# EAGLE design icetube (EAGLE 6.4)
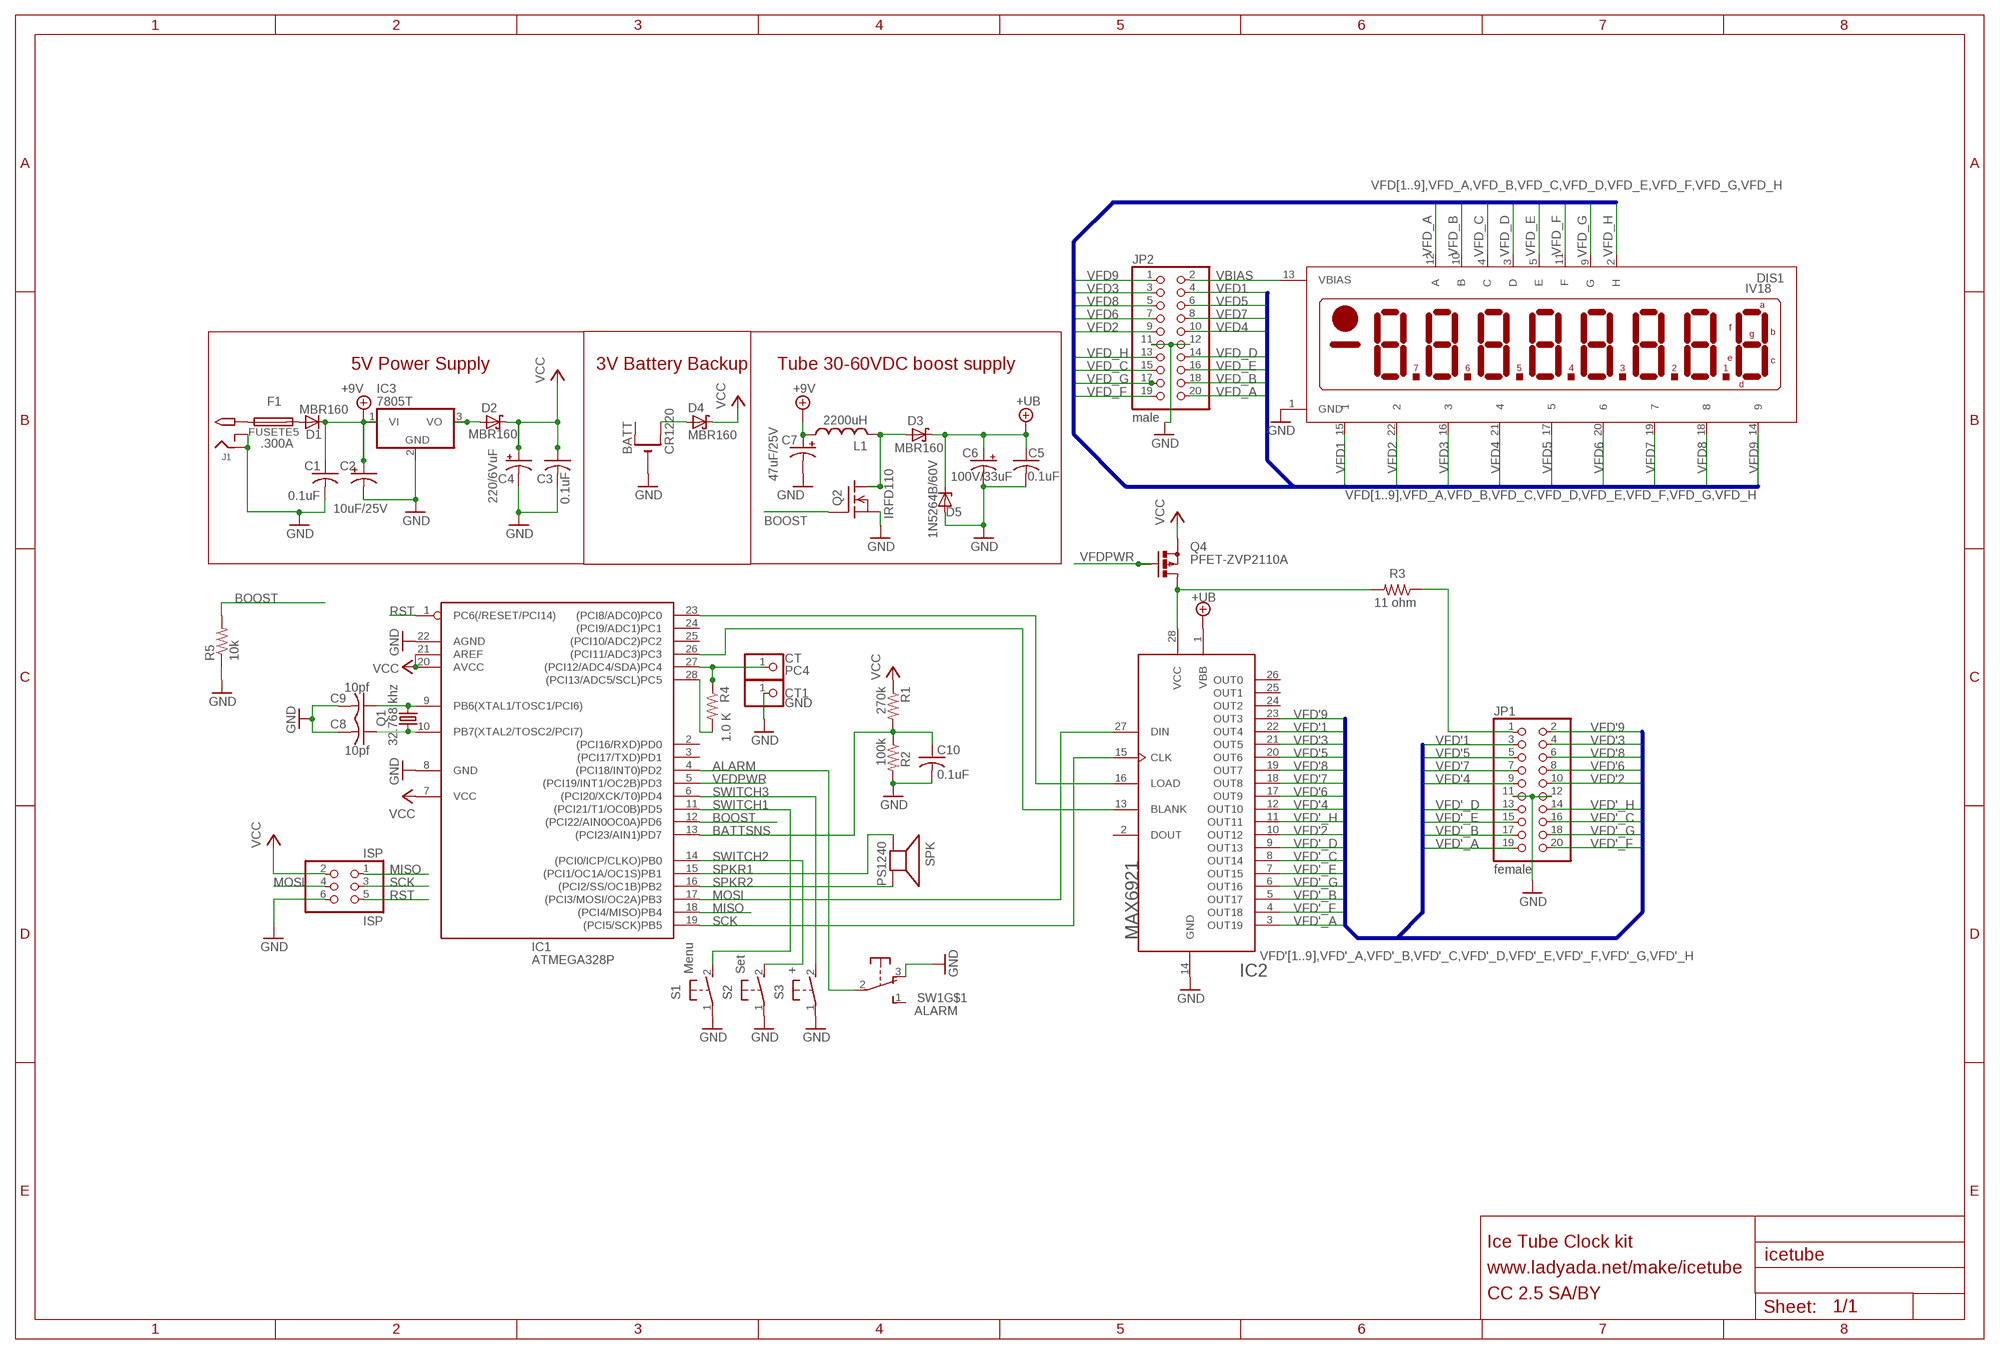
[diagram p0: schematic, sheet 1]

## Parts
BATT  CR1220  CR1220THM  [CR1220-THM]
C1  0.1uF  C-US025-025X050  [C025-025X050]
C2  10uF/25V  CPOL-USE2.5-6  [E2,5-6]
C3  0.1uF  C-US025-025X050  [C025-025X050]
C4  220/6VuF  CPOL-USE2.5-6  [E2,5-6]
C5  0.1uF  C-US025-024X044  [C025-024X044]
C6  100V/33uF  CPOL-USE3.5-8  [E3,5-8]
C7  47uF/25V  CPOL-USE2.5-6  [E2,5-6]
C8  10pf  C-US025-025X050  [C025-025X050]
C9  10pf  C-US025-025X050  [C025-025X050]
C10  0.1uF  C-US025-024X044  [C025-024X044]
CT  PC4  PINHD-1X1  [1X01]
CT1  GND  PINHD-1X1  [1X01]
D1  MBR160  1N4004  [DO41-10]
D2  MBR160  SCHOTTKY-DIODEDO41  [DO41-10]
D3  MBR160  SCHOTTKY-DIODEDO41  [DO41-10]
D4  MBR160  SCHOTTKY-DIODEDO41  [DO41-10]
D5  1N5264B/60V  ZENER-DIODEDO41Z10  [DO41Z10]
DIS1  IV18  [IV18]
F1  FUSETE5  [TE5]
IC1  ATMEGA328P  ATMEGA168PROUND  [DIL28/3]
IC2  MAX6921  [PLCC-S28]
IC3  7805T  [TO220H]
ISP  ISP  PINHD-2X3  [2X03]
J1  2.1MMJACKTHM  [PJ-102A]
JP1  female  PINHD-2X10  [2X10]
JP2  male  PINHD-2X10  [2X10]
L1  2200uH  L  [6000]
Q1  32.768 khz  CRYTALTC26V  [TC26V]
Q2  IRFD110  [DIL04]
Q4  PFET-ZVP2110A  PFETZVP3306  [TO92-OVAL]
R1  270k  R-US_0207/10  [0207/10]
R2  100k  R-US_0207/10  [0207/10]
R3  11 ohm  R-US_0207/10  [0207/10]
R4  1.0 K  R-US_0207/5V  [0207/5V]
R5  10k  R-US_0207/5V  [0207/5V]
S1  Menu  31-XX  [B3F-31XX]
S2  Set  31-XX  [B3F-31XX]
S3  +  31-XX  [B3F-31XX]
SPK  PS1240  SPEAKER/PS12  [PS12]
SW1  ALARM  OS102011MA1Q  [OS102011MA1Q]

## Nets
+9V: C1.1 C2.+ C7.+ D1.C IC3.1(VI) L1.1
+UB: C5.1 C6.+ D3.C D5.C IC2.1(VBB)
ALARM: IC1.4((PCI18/INT0)PD2) SW1.2(P)
BATTSNS: C10.1 IC1.13((PCI23/AIN1)PD7) R1.2 R2.1
BLANK: IC1.26((PCI11/ADC3)PC3) IC2.13(BLANK)
BOOST: IC1.12((PCI22/AIN0OC0A)PD6) Q2.3(G) R5.2
GND: BATT.- C1.2 C2.- C3.2 C4.- C5.2 C6.- C7.- C8.2 C9.2 C10.2 CT1.1 D5.A DIS1.1(GND) IC1.8(GND) IC1.22(AGND) IC2.14(GND) IC3.2(GND) ISP.6 J1.RING J1.RING_SW JP1.11 JP1.12 JP2.11 JP2.12 Q2.4(S) R2.2 R5.1 S1.1(P) S2.1(P) S3.1(P) SW1.3(O)
LOAD: IC1.23((PCI8/ADC0)PC0) IC2.16(LOAD)
MISO: IC1.18((PCI4/MISO)PB4) ISP.1
MOSI: IC1.17((PCI3/MOSI/OC2A)PB3) IC2.27(DIN) ISP.4
N$1: C9.1 IC1.9(PB6(XTAL1/TOSC1/PCI6)) Q1.2
N$2: D3.A L1.2 Q2.1(D) Q2.2(D1)
N$3: C8.1 IC1.10(PB7(XTAL2/TOSC2/PCI7)) Q1.1
N$4: F1.1 J1.TIP
N$5: D1.A F1.2
N$10: BATT.+2(+1) D4.A
N$11: IC1.28((PCI13/ADC5/SCL)PC5) R4.2
N$34: JP1.1 R3.1
N$39: IC2.28(VCC) Q4.3(D) R3.2
N$52: CT.1 IC1.27((PCI12/ADC4/SDA)PC4) R4.1
N$53: D2.A IC3.3(VO)
RST: IC1.1(PC6(/RESET/PCI14)) ISP.5
SCK: IC1.19((PCI5/SCK)PB5) IC2.15(CLK) ISP.3
SPKR1: IC1.15((PCI1/OC1A/OC1S)PB1) SPK.P$1(+)
SPKR2: IC1.16((PCI2/SS/OC1B)PB2) SPK.P$2(-)
SWITCH1: IC1.11((PCI21/T1/OC0B)PD5) S1.2(S)
SWITCH2: IC1.14((PCI0/ICP/CLKO)PB0) S2.2(S)
SWITCH3: IC1.6((PCI20/XCK/T0)PD4) S3.2(S)
VBIAS: DIS1.13(VBIAS) JP2.2
VCC: C3.1 C4.+ D2.C D4.C IC1.7(VCC) IC1.20(AVCC) IC1.21(AREF) ISP.2 Q4.1(S) R1.1
VFD1: DIS1.15 JP2.4
VFD2: DIS1.22 JP2.9
VFD3: DIS1.16 JP2.3
VFD4: DIS1.21 JP2.10
VFD5: DIS1.17 JP2.6
VFD6: DIS1.20 JP2.7
VFD7: DIS1.19 JP2.8
VFD8: DIS1.18 JP2.5
VFD9: DIS1.14 JP2.1
VFD'1: IC2.22(OUT4) JP1.3
VFD'2: IC2.10(OUT12) JP1.10
VFD'3: IC2.21(OUT5) JP1.4
VFD'4: IC2.12(OUT10) JP1.9
VFD'5: IC2.20(OUT6) JP1.5
VFD'6: IC2.17(OUT9) JP1.8
VFD'7: IC2.18(OUT8) JP1.7
VFD'8: IC2.19(OUT7) JP1.6
VFD'9: IC2.23(OUT3) JP1.2
VFD'_A: IC2.3(OUT19) JP1.19
VFD'_B: IC2.5(OUT17) JP1.17
VFD'_C: IC2.8(OUT14) JP1.16
VFD'_D: IC2.9(OUT13) JP1.13
VFD'_E: IC2.7(OUT15) JP1.15
VFD'_F: IC2.4(OUT18) JP1.20
VFD'_G: IC2.6(OUT16) JP1.18
VFD'_H: IC2.11(OUT11) JP1.14
VFD_A: DIS1.12(A) JP2.20
VFD_B: DIS1.10(B) JP2.18
VFD_C: DIS1.4(C) JP2.15
VFD_D: DIS1.3(D) JP2.14
VFD_E: DIS1.5(E) JP2.16
VFD_F: DIS1.11(F) JP2.19
VFD_G: DIS1.9(G) JP2.17
VFD_H: DIS1.2(H) JP2.13
VFDPWR: IC1.5((PCI19/INT1/OC2B)PD3) Q4.2(G)
Unconnected: BATT.+1(+) IC1.2((PCI16/RXD)PD0) IC1.3((PCI17/TXD)PD1) IC1.24((PCI9/ADC1)PC1) IC1.25((PCI10/ADC2)PC2) IC2.2(DOUT) IC2.24(OUT2) IC2.25(OUT1) IC2.26(OUT0) SW1.1(S) SW1.MT1(MT) SW1.MT2(MT)

## Buses
VFD[1..9],VFD_A,VFD_B,VFD_C,VFD_D,VFD_E,VFD_F,VFD_G,VFD_H
VFD'[1..9],VFD'_A,VFD'_B,VFD'_C,VFD'_D,VFD'_E,VFD'_F,VFD'_G,VFD'_H

## Notes on the sheet
- 5V Power Supply | 3V Battery Backup | Tube 30-60VDC boost supply
- Ice Tube Clock kit
- www.ladyada.net/make/icetube
- CC 2.5 SA/BY

## Library data of the parts
BATT = adafruit:CR1220: CR1216/CR1220/CR1225 12mm 3V lithium coin cell Great for battery packup. Both SMT and THM holders. Note the THM package has the ground pads on both sides of the PCB so that the masks are the same - this reduces the cost
C1 C3 C8 C9 = minimidi:C-US: CAPACITOR, American symbol
C2 C4 C7 = minimidi:CPOL-US: POLARIZED CAPACITOR, American symbol
C5 C10 = rcl-ez:C-US: CAPACITOR, American symbol
C6 = rcl-ez:CPOL-US: POLARIZED CAPACITOR, American symbol
CT CT1 = ybox2:PINHD-1X1: PIN HEADER
D1 = minimidi:1N4004: DIODE general purpose rectifier, 1 A
D2-D4 = usbbuck:SCHOTTKY-DIODE: Schottky Diode
D5 = diode:ZENER-DIODE: Z-Diode
DIS1 = vfd:IV18: LCD DISPLAY 8-character 7 segment
F1 = fuse:FUSE: Fuse; MF: .300A; OC_FARNELL: unknown; OC_NEWARK: unknown
IC1 = avr:ATMEGA168*P: MICROCONTROLLER 16 kBytes FLASH 1 kBytes SRAM 512 Bytes EEPROM USART 8-channel 10 bit ADC
IC2 = vfd:MAX6921
IC3 = linear:78*: Positive VOLTAGE REGULATOR Source: http://cache.national.com/ds/LM/LM78L05.pdf http://www.fairchildsemi.com/ds/LM/LM7805.pdf
ISP = pinhead-ez:PINHD-2X3: PIN HEADER
J1 = adafruit:2.1MMJACK: 2.1mm x 5.5mm THM DC jack with internal switch. Digikey part #PJ-102A, 4UCON part #05537 2.1mm x 5.5mm SMT DC jack with internal switch. Digikey part #PJ-002A-SMT, 4UCON part #03267 By microbuilder.eu & adafruit.com
JP1 JP2 = pinhead:PINHD-2X10: PIN HEADER
L1 = usbbuck:L
Q1 = crystal:CRYTAL: CRYSTAL
Q2 = vfd:IRFD110
Q4 = adafruit:PFET: P-CHANNEL MOS FET
R1-R5 = minimidi:R-US_: RESISTOR, American symbol
S1-S3 = switch-omron:31-XX: OMRON SWITCH; MPN: B3F-3100; OC_FARNELL: 959704; OC_NEWARK: 36M3582
SPK = ybox2:SPEAKER: SPEAKER Source: Buerklin
SW1 = adafruit:OS102011MA1Q: OS10201MA1Q through-hole right angle switch http://www.ladyada.net/library/eagle

## Board
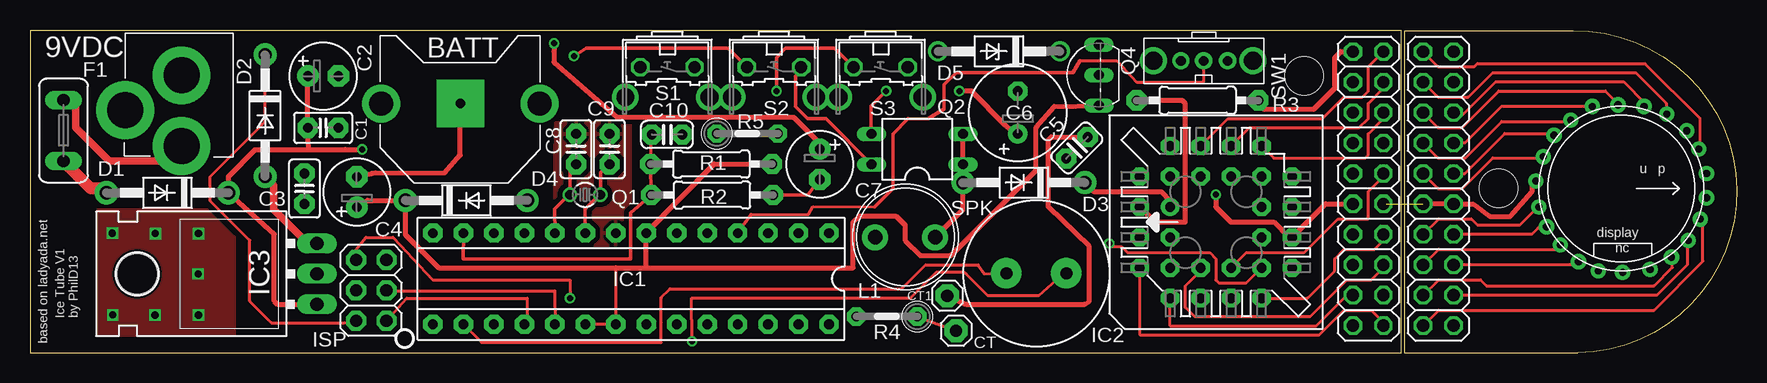
[diagram p1: board, top side]
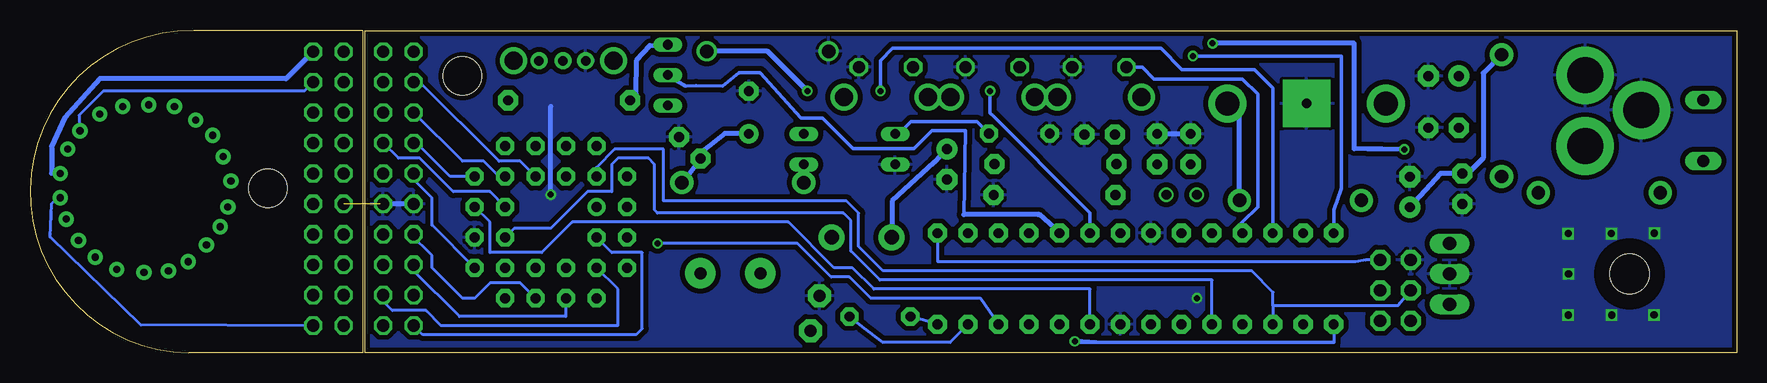
[diagram p2: board, bottom side, seen from below]

Size 142.26 x 26.87 mm. Coordinates in mm from the lower left corner, seen from the top.
Outline: 0,0.01 114.33,0.01
Outline: 114.33,0.01 114.33,26.87 0,26.87 0,0.01
Outline: 114.55,26.87 114.55,0
Outline: 114.55,0.01 129.03,0.01 arc180 128.64,26.87 114.55,26.87
Outline: 0,0.01 114.33,0.01
Copper layers (1*16): Top 0.0356mm / dielectric 1.5011mm / Bottom 0.0356mm
Design rules "osh_boards": minimum track width 6mil, minimum drill 13mil, track to track 6mil, track to pad 6mil, pad to pad 6mil, via to via 6mil, smd to smd 6mil, copper to edge 15mil, drill to drill 6mil, minimum pad ring 7mil, minimum via ring 7mil, stop-mask expansion 4mil, vias tented up to drill 0mil, thermal gap 10mil
Holes 3.2 mm at 106.22,23.1 122.43,13.72

### Footprints (pad centres in the part's own frame; a part is rotated, then mirrored left to right if it is on the bottom)
CR1220-THM = drill 2 pad 3.175: +1 -6.604,0; +2 6.604,0 | drill 0.8 pad 3.962 square: - 0,0
C025-025X050 = drill 0.813 pad 1.676 octagon: 1 -1.27,0; 2 1.27,0
E2,5-6 = drill 0.813 pad 1.778: + -1.27,0 | drill 0.813 pad 1.778 octagon: - 1.27,0
C025-024X044 = drill 0.813 pad 1.676 octagon: 1 -1.27,0; 2 1.27,0
E3,5-8 = drill 0.813 pad 1.6: + -1.778,0 | drill 0.813 pad 1.6 octagon: - 1.778,0
1X01 = drill 1.016 pad 1.93 octagon: 1 0,0
DO41-10 = drill 1.118 pad 1.93: A 5.08,0; C -5.08,0
DO41Z10 = drill 1.118: A 5.08,0; C -5.08,0
IV18 = drill 0.6 pad 1.27: 1 -0.635,-7.112; 2 1.524,-6.858; 3 3.175,-6.223; 4 4.699,-5.08; 5 6.096,-3.556; 6 6.858,-1.905; 7 6.985,0.127; 8 6.731,2.413; 9 5.715,4.191; 10 4.318,5.588; 11 2.54,6.604; 12 0.762,7.112; 13 -1.27,7.112; 14 -3.302,6.477; 15 -4.826,5.461; 16 -6.223,3.81; 17 -6.858,1.905; 18 -6.985,-0.254; 19 -6.858,-2.413; 20 -5.715,-4.191; 21 -4.445,-5.588; 22 -2.667,-6.477
TE5 = drill 1.016 long: 1 -2.54,0; 2 2.54,0
DIL28/3 = drill 0.813 pad 1.6 octagon: 1 -16.51,-3.81; 2 -13.97,-3.81; 3 -11.43,-3.81; 4 -8.89,-3.81; 5 -6.35,-3.81; 6 -3.81,-3.81; 7 -1.27,-3.81; 8 1.27,-3.81; 9 3.81,-3.81; 10 6.35,-3.81; 11 8.89,-3.81; 12 11.43,-3.81; 13 13.97,-3.81; 14 16.51,-3.81; 15 16.51,3.81; 16 13.97,3.81; 17 11.43,3.81; 18 8.89,3.81; 19 6.35,3.81; 20 3.81,3.81; 21 1.27,3.81; 22 -1.27,3.81; 23 -3.81,3.81; 24 -6.35,3.81; 25 -8.89,3.81; 26 -11.43,3.81; 27 -13.97,3.81; 28 -16.51,3.81
PLCC-S28 = drill 0.813 pad 1.524: 1 1.27,3.81 | drill 0.813 pad 1.524 octagon: 2 -1.27,6.35; 3 -1.27,3.81; 4 -3.81,6.35; 5 -6.35,3.81; 6 -3.81,3.81; 7 -6.35,1.27; 8 -3.81,1.27; 9 -6.35,-1.27; 10 -3.81,-1.27; 11 -6.35,-3.81; 12 -3.81,-6.35; 13 -3.81,-3.81; 14 -1.27,-6.35; 15 -1.27,-3.81; 16 1.27,-6.35; 17 1.27,-3.81; 18 3.81,-6.35; 19 6.35,-3.81; 20 3.81,-3.81; 21 6.35,-1.27; 22 3.81,-1.27; 23 6.35,1.27; 24 3.81,1.27; 25 6.35,3.81; 26 3.81,6.35; 27 3.81,3.81; 28 1.27,6.35
TO220H = drill 1.118 long: 1 -2.54,-10.16; 2 0,-10.16; 3 2.54,-10.16 | hole 3.302: 0,4.826
2X03 = drill 1.016 pad 1.676 octagon: 1 -2.54,-1.27; 2 -2.54,1.27; 3 0,-1.27; 4 0,1.27; 5 2.54,-1.27; 6 2.54,1.27
PJ-102A = drill 3 pad 4.8: RING 0.1,-3.39; RING_SW -4.6,-6.29; TIP 0.1,-9.29
2X10 = drill 1.016 octagon: 1 -11.43,-1.27; 2 -11.43,1.27; 3 -8.89,-1.27; 4 -8.89,1.27; 5 -6.35,-1.27; 6 -6.35,1.27; 7 -3.81,-1.27; 8 -3.81,1.27; 9 -1.27,-1.27; 10 -1.27,1.27; 11 1.27,-1.27; 12 1.27,1.27; 13 3.81,-1.27; 14 3.81,1.27; 15 6.35,-1.27; 16 6.35,1.27; 17 8.89,-1.27; 18 8.89,1.27; 19 11.43,-1.27; 20 11.43,1.27
6000 = drill 1.2 pad 2.184: 1 -2.5,0; 2 2.5,0
TC26V = drill 0.813: 1 -1.27,0; 2 1.27,0
DIL04 = drill 0.813 long: 1 -1.27,-3.81; 2 1.27,-3.81; 3 1.27,3.81; 4 -1.27,3.81
TO92-OVAL = drill 0.813 long: 1 -2.54,0; 2 0,0; 3 2.54,0
0207/10 = drill 0.813 pad 1.676 octagon: 1 -5.08,0; 2 5.08,0
0207/5V = drill 0.813 pad 1.524 octagon: 1 -2.54,0; 2 2.54,0
B3F-31XX = drill 1.016 octagon: 1 -2.261,-1.245; 2 2.261,-1.245 | drill 1.499 pad 2.159: 3 -3.505,1.245; 4 3.505,1.245
PS12 = drill 1 pad 2.54: P$1 -2.5,0; P$2 2.5,0
OS102011MA1Q = drill 0.8 pad 1.422: 1 -2,0; 2 0,0; 3 1.9,0 | drill 1.5 pad 2.184: MT1 -4.1,0; MT2 4.2,0

### Placement (x,y rotation side)
BATT  35.86,20.81 0 top
C1  24.43,18.78 0 top
C2  24.43,23.1 0 top
C3  22.88,13.7 270 top
C4  27.25,13.43 90 top
C5  87.27,17.11 45 top
C6  82.34,20.05 90 top
C7  65.83,15.73 270 top
C8  45.51,17 90 top
C9  48.3,17 90 top
C10  53.1,18.22 0 top
CT  77.19,1.85 0 top
CT1  76.46,4.76 0 top
D1  11.45,13.35 180 top
D2  19.6,19.79 270 top
D3  82.85,14.21 180 top
D4  36.37,12.72 0 top
D5  80.77,25.15 180 top
DIS1  132.63,13.7 270 top
F1  2.79,18.55 270 top
IC1  50.1,6.18 180 top
IC2  98.85,10.9 90 top
IC3  13.76,6.59 90 top
ISP  28.45,5.22 90 top
J1  12.54,26.55 0 top
JP1  111.55,13.7 270 top
JP2  117.39,13.7 270 top
L1  72.94,9.63 0 top
Q1  46.27,13.19 0 top
Q2  73.96,17 90 top
Q4  89.1,23.18 90 top
R1  56.79,15.75 180 top
R2  56.86,13.17 0 top
R3  97.33,21.06 180 top
R4  71.42,3.03 180 top
R5  59.8,18.3 0 top
S1  53.13,22.59 180 top
S2  62.02,22.59 180 top
S3  70.91,22.59 180 top
SPK  83.89,6.64 180 top
SW1  97.83,24.37 180 top

### Tracks (layer width: path | path; a pad name or v marks a point on that pad's centre or on a via)
+9V  (via drill 0.5)
  Top 0.406: C2.+ C1.1 23.22,16.98 | 23.22,16.98 26.31,16.98 v27.7,16.97 | IC3.1 20.62,4.05 20.36,4.3 20.36,9.89 D1.C 16.55,14.72 18.75,16.96 23.22,16.98 | 43.69,25.51 43.69,25.15 | 43.69,25.15 43.69,24.27 48.94,19.67 63.65,19.67 65.78,17.53 65.78,17.03 65.81,17 C7.+ | v43.69,25.82 43.69,25.79 43.69,25.15
  Bottom 0.254: 70.4,9.64 L1.1
  Bottom 0.406: C7.+ 66.35,16.46 66.93,15.88 70.4,12.66 70.4,9.64 | v27.7,16.97 29.59,17.01 30.77,17.01 31.87,17.03 31.87,18.17 31.87,25.82 v43.69,25.82
+UB  (via drill 0.5)
  Top 0.406: D3.C 88.69,13.45 94.28,13.45 95.04,12.68 IC2.1 | C6.+ 81.77,18.54 81.33,18.96 78.48,21.85 v77.47,21.85
  Bottom 0.254: 88.06,14.08 D3.C 87.67,14.46
  Bottom 0.305: C6.+ 82.37,18.3
  Bottom 0.406: 87.9,14.2 87.67,14.46 86.83,15.59 C5.1 86.28,16.75 84.35,18.3 82.37,18.3 | D5.C 80.77,25.15 v77.47,21.85
ALARM
  Top 0.254: 60.12,11.54 64.89,11.54 65.28,12.2 70.4,12.18 | 87.54,24.38 90.59,24.38 92.25,22.59 97.83,22.59 SW1.2 | 73.2,19.54 74.9,19.54 74.93,19.57
  Top 0.305: 73.2,19.54 71.93,18.27 71.93,13.7 70.4,12.18 | IC1.4 60.12,11.54 | 87.54,24.38 86.94,23.38 77.21,23.38 76.2,22.36 76.2,20.33 74.93,19.57
BATTSNS
  Top 0.254: C10.1 51.73,15.73 R1.2
  Top 0.305: IC1.13 36.11,7.86 50.08,7.86 50.08,11.67 51.86,13.19 R2.1 | R2.1 51.84,13.21 | R2.1 R1.2
BLANK  (via drill 0.5)
  Top 0.254: IC2.13 101.39,5.83 99.1,5.83 98.85,6.08 98.85,7.86 98.34,8.37 91.48,8.37 90.98,8.87 89.96,8.87 v89.96,9.13
  Bottom 0.254: IC1.26 63.04,4.56 72.18,4.56 73.96,6.33 75.48,6.33 78.28,9.13 v89.96,9.13
BOOST  (via drill 0.5)
  Top 0.305: Q2.3 70.1,18.22 70.1,18.3 70.1,20.58 v71.37,21.85
  Top 0.406: Q2.3 70.1,18.27 70.1,18.3
  Bottom 0.305: IC1.12 38.65,22.08 40.2,23.63 45.97,23.63 46.23,23.63 48,25.41 70.36,25.41 71.37,24.39 v71.37,21.85 | R5.2 63.35,19.31 68.83,19.31 69.85,18.3 70.12,18.3 Q2.3
GND  (via drill 0.5, 0.6)  (1 unrouted)
  Top 0.254: IC1.22 51.35,2.78 | 64.31,23.83 S2.1 64.26,23.86 | v45,4.56 45,6.08 33.57,6.08 30.27,9.64 27.98,9.64 27.16,8.59 ISP.6 | 118.87,12.45 118.69,12.45 JP2.12 | JP2.11 116.15,12.45 | 125.52,14.28 DIS1.1
  Top 0.305: 64.26,23.86 64.05,23.86 64.05,23.35 63.8,23.1 63.8,20.56 64.81,19.54 66.34,19.54 Q2.4 | C7.- 65.81,14.46 65.78,14.49 64.85,13.17 R2.2
  Top 0.406: JP1.11 107.99,12.43 IC2.14 104.95,9.64 103.68,10.91 100.12,10.91 99.87,11.16 98.85,12.18 v98.85,13.19 | CT1.1 78.02,4.05 87.93,4.05 88.31,4.3 88.31,8.87 84.88,12.18 84.88,17.76 85.13,18.02 88.18,18.02 | 88.18,18.02 88.44,18.02 | 88.18,18.02 C5.2 | C4.- 28.49,14.97 28.77,15.03 34.56,15.01 35.86,16.49 BATT.- | 116.15,12.45 118.69,12.45 | JP2.12 120.31,12.4 121.67,11.39 123.38,11.39 125.22,13.47 125.22,13.98 125.52,14.28
  Bottom 0.406: 113.07,12.43 JP1.12 JP1.11 | v98.85,13.19 98.85,20.56 | C8.2 46.48,18.27 47.39,18.26 47.89,18.25 48.41,18.24
  other vias: 6.86,9.97 10.44,9.96 14.04,9.96 14.01,6.59 14.04,3.14 10.41,3.15 6.89,3.16
  pour Bottom (isolate 0.406): 0.14,26.78 0.14,0.11 114.22,0.11 114.22,26.78
  pour Top: 5.63,11.92 5.63,1.51 17.06,1.51 17.06,9.63 14.78,11.92
  pour Top (isolate 0.406): 43.81,19.19 43.69,8.9 50.04,9.03 50.04,19.19
LOAD
  Bottom 0.254: 105.45,12.43 IC2.16 103.93,10.91 103.93,8.37 99.61,8.37 97.07,10.91 79.04,10.91 75.23,7.1 73.7,7.1 71.93,5.32 53.89,5.32 IC1.23
MISO
  Top 0.254: IC1.18 41.45,3.03 41.45,4.56 31.4,4.56 ISP.1
MOSI
  Bottom 0.254: 38.65,3.92 IC1.17 | 38.65,3.92 38.65,5.06 40.43,6.84 71.16,6.84 73.2,8.87 73.2,11.67 74.21,12.68 89.45,12.68 89.45,17 93.52,17 95.04,15.48 IC2.27 | ISP.4 28.24,3.92 38.65,3.92
N$1
  Top 0.305: IC1.9 46.27,11.99 47.47,13.19 Q1.2 47.54,15.04 48.26,15.76 48.28,15.73 C9.1
N$2
  Top 0.406: L1.2 77.77,11.96 D3.A Q2.1 Q2.2
N$3
  Top 0.305: C8.1 45.49,15.73 45.46,15.76 45,15.3 Q1.1 44.98,13.19 44.96,13.22 43.73,11.99 IC1.10
N$4
  Top 0.61: J1.TIP 12,16.01 6.6,16.01 3.81,18.8 3.81,20.84 3.3,21.34 2.79,21.34 F1.1
N$5
  Top 1.016: D1.A 6.37,13.72 5.08,13.72 F1.2
N$10
  Bottom 0.406: BATT.+2 41.45,20.81 D4.A
N$11
  Bottom 0.254: IC1.28 R4.2
N$34
  Top 0.254: 102.38,21.09 102.36,21.09 102.36,20.84
  Top 0.406: JP1.1 109.26,25.13 108.76,24.62 108.76,22.08 107,20.33 102.87,20.33 102.36,20.84 | R3.1 102.38,21.09
N$39
  Top 0.406: IC2.28 93.77,10.91 96.31,10.91 96.31,20.81 96.06,21.07 R3.2
  Bottom 0.305: R3.2 91.74,21.57
  Bottom 0.406: 91.74,21.57 91.68,24.41 90.6,25.64 Q4.3
N$52
  Top 0.254: R4.1 74.48,2.84 CT.1
  Bottom 0.254: IC1.27 65.58,0.87 71.16,0.87 72.88,2.18 R4.1
N$53
  Top 0.61: IC3.3 23.14,9.13 20.32,11.95 20.32,13.98 19.6,14.69 D2.A
RST
  Bottom 0.254: 66.59,10.4 66.59,10.14 | 66.59,10.4 IC1.1 | 66.59,10.4 66.59,7.6 31.79,7.6 30.92,7.75 ISP.5
SCK
  Top 0.254: IC1.19 43.73,5.19 29.76,5.19 ISP.3
  Bottom 0.254: IC1.19 43.73,6.08 71.42,6.08 73.83,8.49 73.83,11.03 74.47,11.67 89.96,11.67 90.21,11.92 90.21,15.73 90.72,16.24 93.26,16.24 93.77,15.73 93.77,13.45 95.8,13.45 98.85,10.4 101.9,10.4 IC2.15
SPKR1  (via drill 0.5)
  Top 0.254: 86.4,6.84 SPK.P$1 86.28,6.71 84.12,4.81 79.8,4.81 78.02,6.59 78,6.59 77.85,6.74 75.56,6.74 73.4,4.58 55.16,4.58 v55.18,0.96
  Bottom 0.254: 33.57,0.87 33.57,1.76 IC1.15 | 55.12,1.02 52.8,0.87 v55.18,0.96
  Bottom 0.305: v55.18,0.96 55.27,1 55.24,0.9 52.8,0.87 51.53,0.87 33.57,0.87
SPKR2
  Top 0.254: IC1.16 37.64,0.87 52.62,0.87 52.62,2.52 52.62,4.56 52.6,4.56 52.58,4.58 53.34,5.34 72.64,5.34 74.65,7.35 79.04,7.35 79.55,6.59 SPK.P$2
SWITCH1
  Bottom 0.305: 41.19,10.91 39.92,12.18 39.92,21.57 41.19,22.84 48.56,22.84 49.55,23.83 S1.2 | IC1.11 41.19,10.91 | 41.19,10.91 41.45,10.65
SWITCH2  (via drill 0.5)
  Top 0.305: S2.2 58.19,25.41 46.48,25.41 46.35,25.41 v45.34,24.77
  Bottom 0.305: IC1.14 33.57,11.92 32.94,13.7 32.94,23.86 32.96,24.77 v45.34,24.77
SWITCH3  (via drill 0.5)
  Top 0.305: S3.2 67.08,25.41 62.99,25.41 62.23,24.65 v62.23,21.85
  Bottom 0.305: IC1.6 53.89,11.67 54.4,12.18 62.01,19.78 62.23,20 v62.23,21.85 62.48,21.85
VBIAS
  Bottom 0.254: 139.77,14.99 DIS1.13
  Bottom 0.406: JP2.2 120.92,22.87 136.43,22.89 139.36,19.62 140.45,17.24 140.46,14.99 139.77,14.99
VCC
  Top 0.254: IC1.20 IC1.21 48.81,7.1 | ISP.2 26.21,2.52 20.11,2.52 18.33,4.3 18.33,9.38 15.03,12.68 15.03,14.72 19.6,19.29 D2.C
  Top 0.305: 34.08,7.1 34.06,7.1 34.03,7.12
  Top 0.406: 51.35,7.1 IC1.7 57.01,15.77 R1.1 | 51.35,7.1 48.81,7.1 34.08,7.1 | 51.35,7.1 68.62,7.1 68.62,10.91 69.13,11.41 72.18,11.41 72.94,10.65 72.94,9.38 74.21,8.11 76.75,8.11 83.86,15.22 83.86,18.78 85.39,20.56 Q4.1 | 34.03,7.12 31.29,9.87 D4.C 28.12,12.73 C4.+
  Bottom 0.254: 51.43,10.05 51.37,10.09
  Bottom 0.406: IC1.7 51.43,10.05 | C4.+ 24.68,14.97 C3.1 22.4,14.97 21.13,16.24 21.13,23.35 D2.C
VFD1
  Bottom 0.254: JP2.4 119.4,21.85 136.14,21.85 138.17,19.82 138.17,18.61 DIS1.15
VFD2
  Top 0.254: JP2.9 117.37,13.72 119.38,13.72 121.92,16.26 126.24,16.26 126.24,16.29 DIS1.22
VFD3
  Top 0.254: JP2.3 117.37,21.34 119.89,21.34 121.92,23.38 133.86,23.38 136.4,20.84 136.4,20.07 136.44,20.03 DIS1.16
VFD4
  Top 0.254: JP2.10 119.61,14.97 122.93,18.3 127.2,18.3 | 127.2,18.3 127.25,18.3 | 127.2,18.3 DIS1.21
VFD5
  Top 0.254: DIS1.17 134.56,20.58 134.62,20.58 134.62,20.84 132.84,22.61 122.17,22.61 119.38,19.82 119.12,19.82 118.87,20.07 118.84,20.05 JP2.6
VFD6
  Top 0.254: JP2.7 117.37,16.26 119.63,16.26 122.68,19.31 128.52,19.31 128.52,19.33 DIS1.20
VFD7
  Top 0.254: DIS1.19 130.19,20.58 122.68,20.58 119.63,17.53 118.87,17.53 118.84,17.51 JP2.8
VFD8
  Top 0.254: JP2.5 117.37,18.8 119.38,18.8 122.43,21.85 131.32,21.85 132.33,20.84 132.33,20.64 | 132.33,20.64 132.33,20.58 | 132.33,20.64 DIS1.18
VFD9
  Top 0.254: JP2.1 117.37,23.88 120.39,23.88 120.65,24.14 134.62,24.14 139.19,19.57 139.19,17.03 139.13,17.03 DIS1.14
VFD'1
  Bottom 0.254: IC2.22 101.39,15.99 103.17,15.99 109.77,22.59 JP1.3
VFD'2
  Top 0.254: IC2.10 101.39,8.37 106.22,8.37 109.01,11.16 111.55,11.16 111.55,13.45 112.57,14.46 112.57,14.97 JP1.10
VFD'3
  Top 0.254: IC2.21 101.64,18.78 110.79,18.78 111.55,19.54 111.55,20.81 112.82,22.08 JP1.4
VFD'4
  Bottom 0.254: IC2.12 108.76,10.65 108.76,12.94 110.28,14.46 JP1.9
VFD'5
  Bottom 0.254: JP1.5 106.22,15.99 104.44,15.99 103.17,14.72 IC2.20
VFD'6
  Bottom 0.254: IC2.17 103.93,13.45 106.98,13.45 109.77,16.24 111.55,16.24 JP1.8 113.07,17.51
VFD'7
  Bottom 0.254: IC2.18 107.23,14.72 110.03,17.51 JP1.7
VFD'8
  Top 0.254: IC2.19 103.68,16.24 111.3,16.24 111.55,16.49 111.55,18.27 112.82,19.54 JP1.6
VFD'9
  Top 0.254: IC2.23 99.87,19.54 107.74,19.54 109.52,21.32 111.04,21.32 111.55,21.83 111.55,23.86 JP1.2
VFD'_A
  Bottom 0.254: JP1.19 109.52,1.51 91.74,1.51 91.23,2.02 91.23,8.37 93.77,8.37 IC2.3
VFD'_B
  Top 0.254: IC2.5 95.04,2.27 107.23,2.27 109.77,4.81 JP1.17
VFD'_C
  Top 0.254: IC2.8 97.58,6.84 96.31,5.57 96.31,3.79 97.07,3.03 106.72,3.03 109.77,6.08 111.8,6.08 112.82,7.1 JP1.16
VFD'_D
  Bottom 0.254: IC2.9 101.39,5.83 103.93,5.83 105.2,4.56 106.22,4.56 108.76,7.1 108.76,8.11 110.53,9.89 JP1.13
VFD'_E
  Bottom 0.254: IC2.7 97.58,3.03 106.47,3.03 110.28,6.84 JP1.15
VFD'_F
  Top 0.254: IC2.4 92.5,1.51 107.49,1.51 109.52,3.54 111.8,3.54 112.57,2.78 112.57,2.52 JP1.20
VFD'_G
  Bottom 0.254: IC2.6 93.26,5.32 93.26,2.27 107.99,2.27 109.26,3.54 112.06,3.54 112.82,4.3 JP1.18
VFD'_H
  Top 0.254: IC2.11 106.47,4.56 108.76,6.84 108.76,7.86 109.52,8.62 112.06,8.62 112.82,9.38 JP1.14
VFD_A
  Bottom 0.254: JP2.20 133.02,2.33 140.59,9.66 140.46,12.45 139.95,12.96 139.93,12.94 DIS1.12
VFD_B
  Top 0.254: JP2.18 118.69,4.83 135.63,4.83 138.17,7.37 138.17,9.41 138.2,9.41 DIS1.10
VFD_C
  Top 0.254: JP2.15 117.42,8.64 127.76,8.64 127.76,8.79 DIS1.4
VFD_D
  Top 0.254: JP2.14 118.69,9.91 125.22,9.91 125.73,10.42 126.31,10.42 DIS1.3
VFD_E
  Top 0.254: DIS1.5 128.85,7.37 118.69,7.37 JP2.16
VFD_F
  Top 0.254: JP2.19 117.42,3.56 135.38,3.56 139.44,7.63 139.44,10.95 DIS1.11
VFD_G
  Top 0.254: JP2.17 117.42,6.1 120.9,6.1 121.41,5.6 135.38,5.6 136.9,7.12 136.9,7.9 DIS1.9
VFD_H
  Top 0.254: JP2.13 117.42,11.18 120.14,11.18 120.65,10.68 124.2,10.68 125.73,12.2 125.75,12.2 DIS1.2
VFDPWR
  Bottom 0.305: 64.42,11.54 64.29,18.53 67.08,18.53 68.58,17.03 73.66,17.03 76.2,19.57 77.98,19.57 81.4,23.4 83.17,23.4 84.55,22.26 86.74,22.28 87.62,22.26 88.32,22.66 88.79,22.98 88.77,22.97 89,23.12 | 89,23.12 89.08,23.19 | 89,23.12 Q4.2
  Bottom 0.406: 64.42,11.54 58.21,11.54 58.14,11.54 57.27,10.8 56.41,10.02 IC1.5

### Text on the board
tPlace: 9VDC | Ice Tube V1 / by PhilD13 | based on ladyada.net